# EasyEDA schematic Coon85.json
TITLE: Coon85; REV: 1.3; Date: 2023-02-16; Sheet: 1/1; Drawn By: Tizfaver
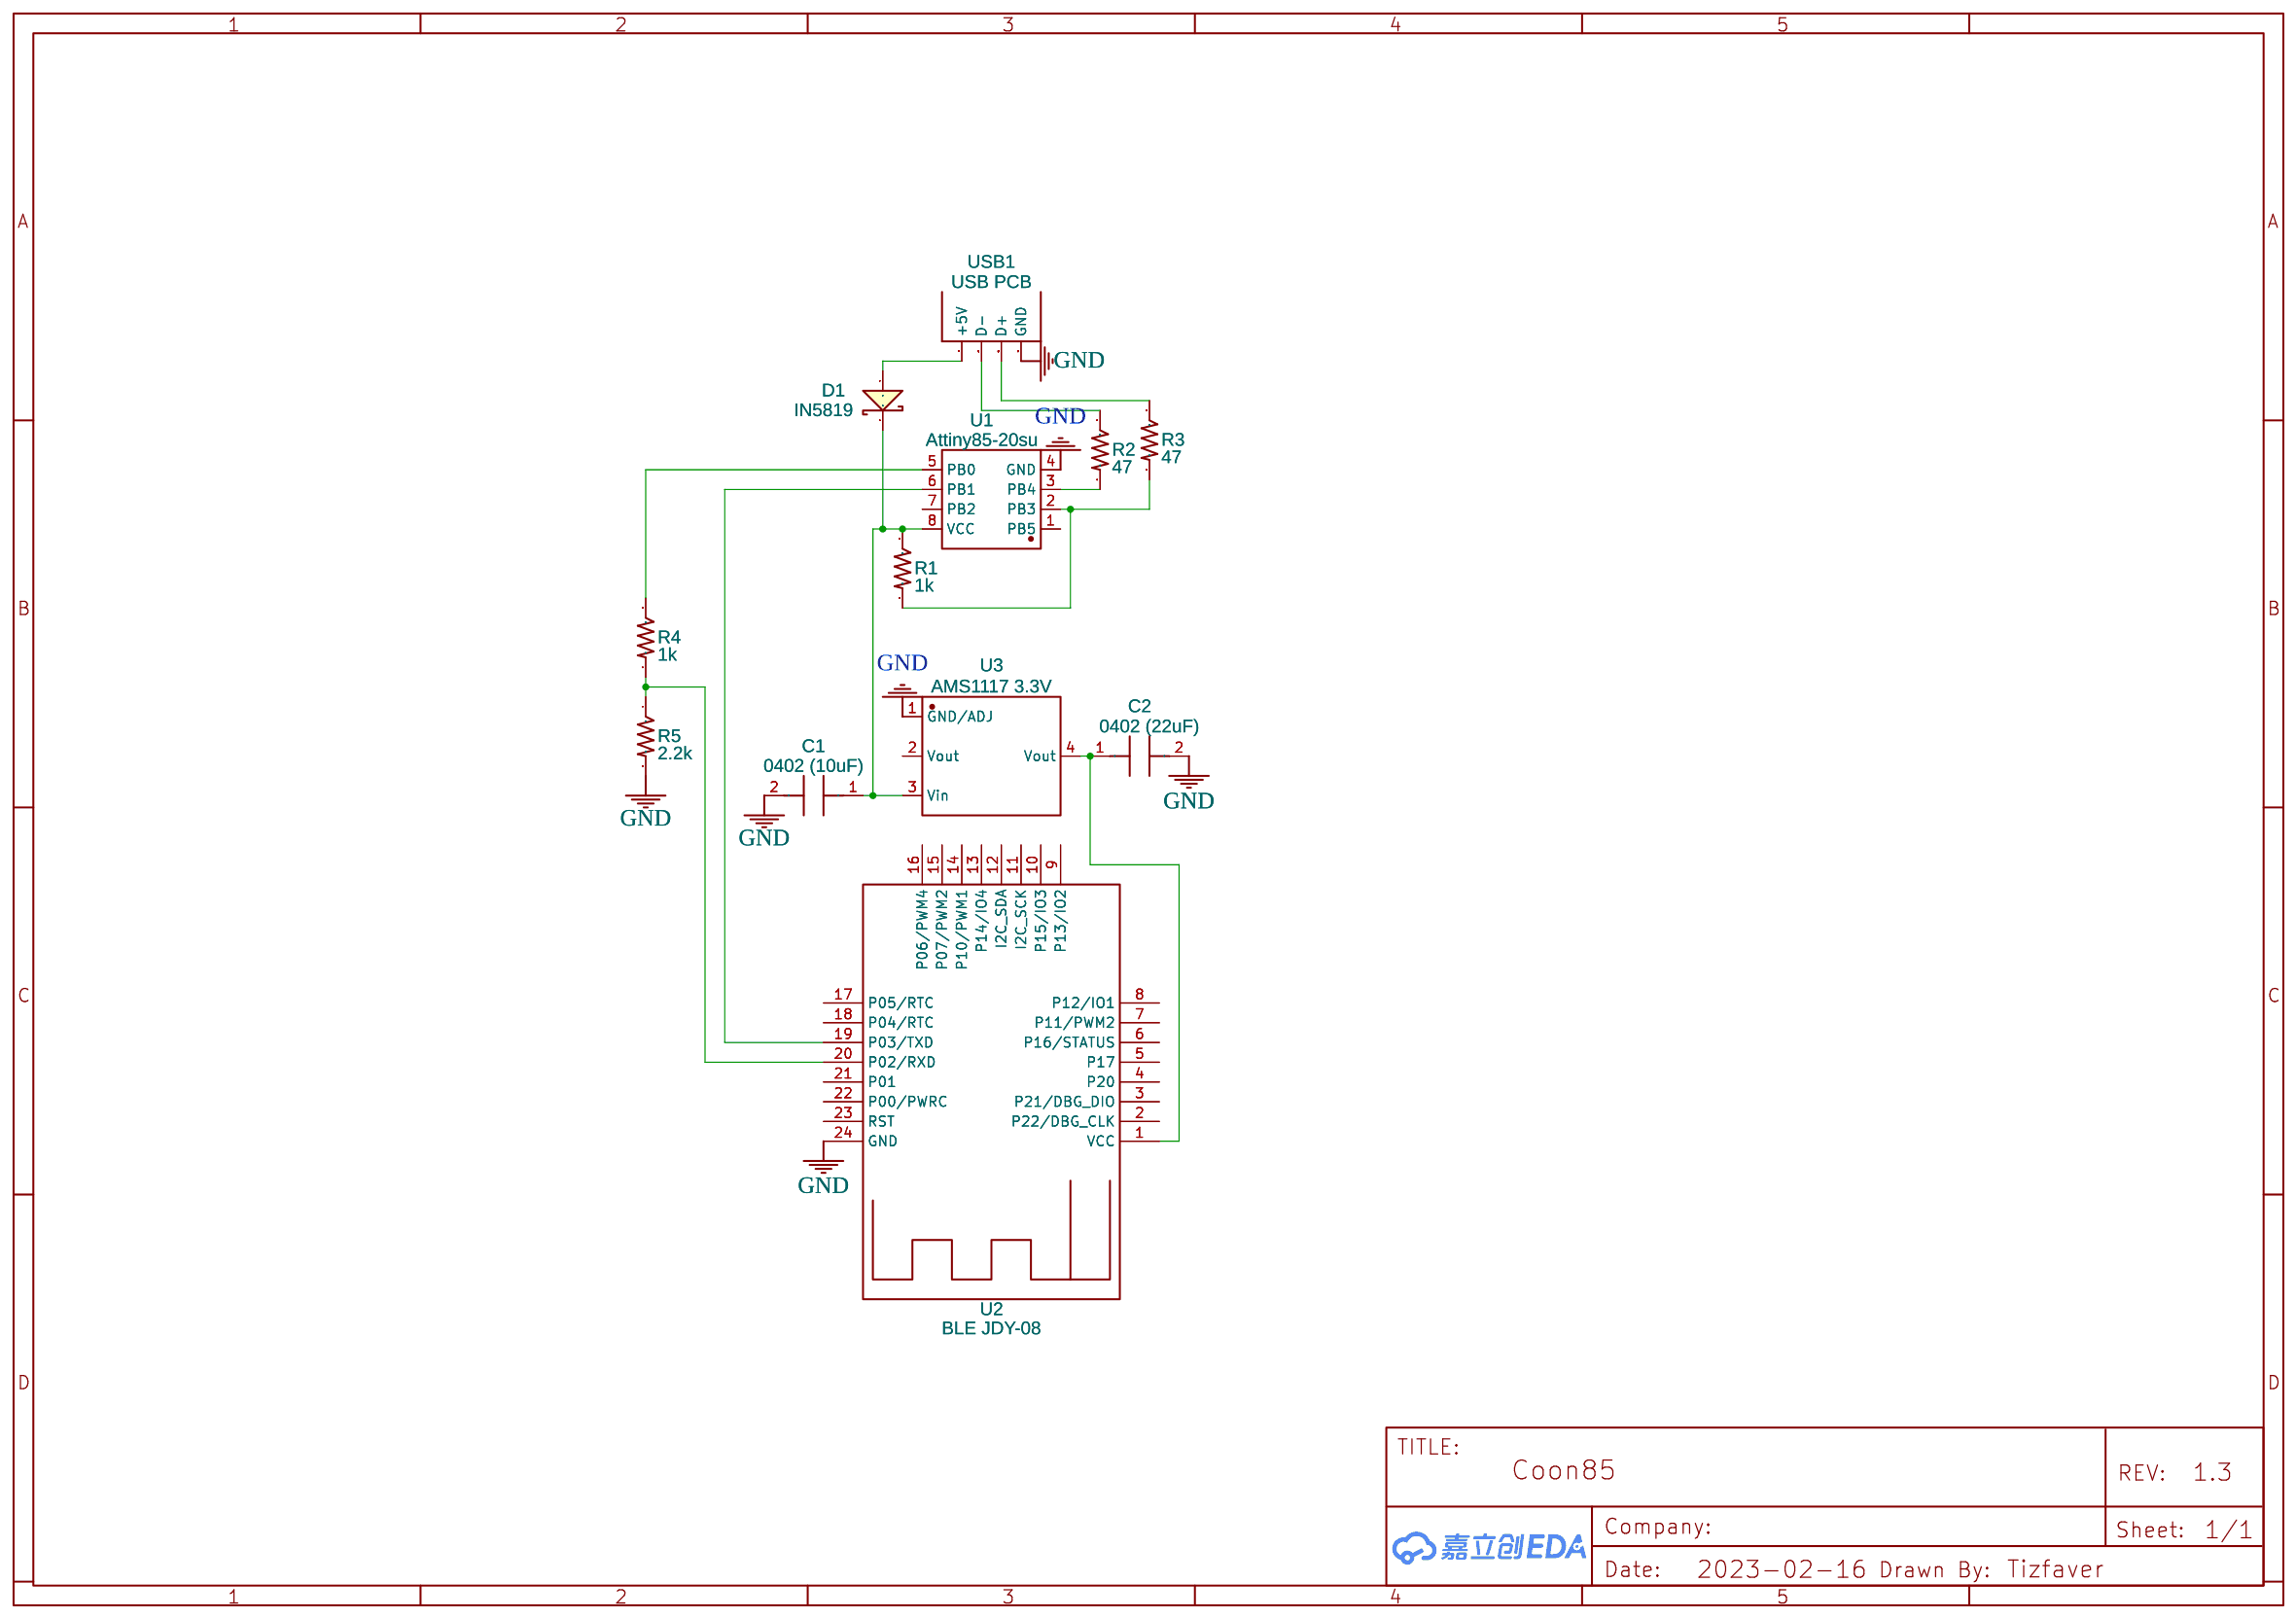
[diagram p0: schematic sheet]

## Parts
C1  0402 (10uF)  [CAPACITOR (SMT) 0402]
C2  0402 (22uF)  [CAPACITOR (SMT) 0402]
D1  IN5819  [SMA/DO-214AC]
R1  1k  [SPARKFUN-RESISTORS_0402-TIGHT]
R2  47  [SPARKFUN-RESISTORS_0402-TIGHT]
R3  47  [SPARKFUN-RESISTORS_0402-TIGHT]
R4  1k  [SPARKFUN-RESISTORS_0402-TIGHT]
R5  2.2k  [SPARKFUN-RESISTORS_0402-TIGHT]
U1  Attiny85-20su  [ATTINY85_01]
U2  BLE JDY-08  [JDY-08]
U3  AMS1117 3.3V  [AMS1117 3.3V]
USB1  USB PCB  [USB-A-PCB]

## Library data of the parts
C1 C2 = Capacitor (SMT) 0402 (0.1uF): Contributor: jwenthold; Supplier Part: 712-1260-1-ND; Supplier: Digi-Key; sourceId: Y4AuMGXR9
D1 = IN5819
R1-R5 = SPARKFUN-RESISTORS_5.1KOHM-0402T-1/16W-1%: Contributor: phillipshahviri
U1 = Attiny85_01: Contributor: skfjhd88
U2 = BLE JDY-08: Contributor: hostilejurist
U3 = AMS1117 3.3V: sourceId: dwIGgezVh; Supplier: LCSC; Manufacturer: AMS; Manufacturer Part: AMS1117-3.3; LCSC Assembly: Yes; image: //image.lceda.cn/szlcsc/C6186.jpg; Supplier Part: C6186; SMT Type: Basic
USB1 = USB PCB: USB Connectors; Contributor: SparkFun

## Nets
GND: C1.2 C2.2 R5.2 U1.4(GND) U2.24(GND) U3.1(GND/ADJ) USB1.GND
Net-(C1-1): C1.1 D1.2 R1.1 U1.8(VCC) U3.3(Vin)
Net-(C2-1): C2.1 U2.1(VCC) U3.4(Vout)
Net-(D1-1): D1.1 USB1.5V(+5V)
Net-(R1-2): R1.2 R3.2 U1.2(PB3)
Net-(R2-1): R2.1 USB1.USB_M(D-)
Net-(R2-2): R2.2 U1.3(PB4)
Net-(R3-1): R3.1 USB1.USB_P(D+)
Net-(R4-1): R4.1 U1.5(PB0)
Net-(R4-2): R4.2 R5.1 U2.20(P02/RXD)
Net-(U1-6): U1.6(PB1) U2.19(P03/TXD)

Not connected (* = marked no-connect by the designer): U1 1(PB5) 7(PB2); U2 2(P22/DBG CLK) 3(P21/DBG DIO) 4(P20) 5(P17) 6(P16/STATUS) 7(P11/PWM2) 8(P12/IO1) 9(P13/IO2) 10(P15/IO3) 11(I2C SCK) 12(I2C SDA) 13(P14/IO4) 14(P10/PWM1) 15(P07/PWM2) 16(P06/PWM4) 17(P05/RTC) 18(P04/RTC) 21(P01) 22(P00/PWRC) 23(RST); U3 2(Vout)
